# Altium schematic sheet AD_DA.SchDoc
size A4; SheetNumber: 1; SheetTotal: 6
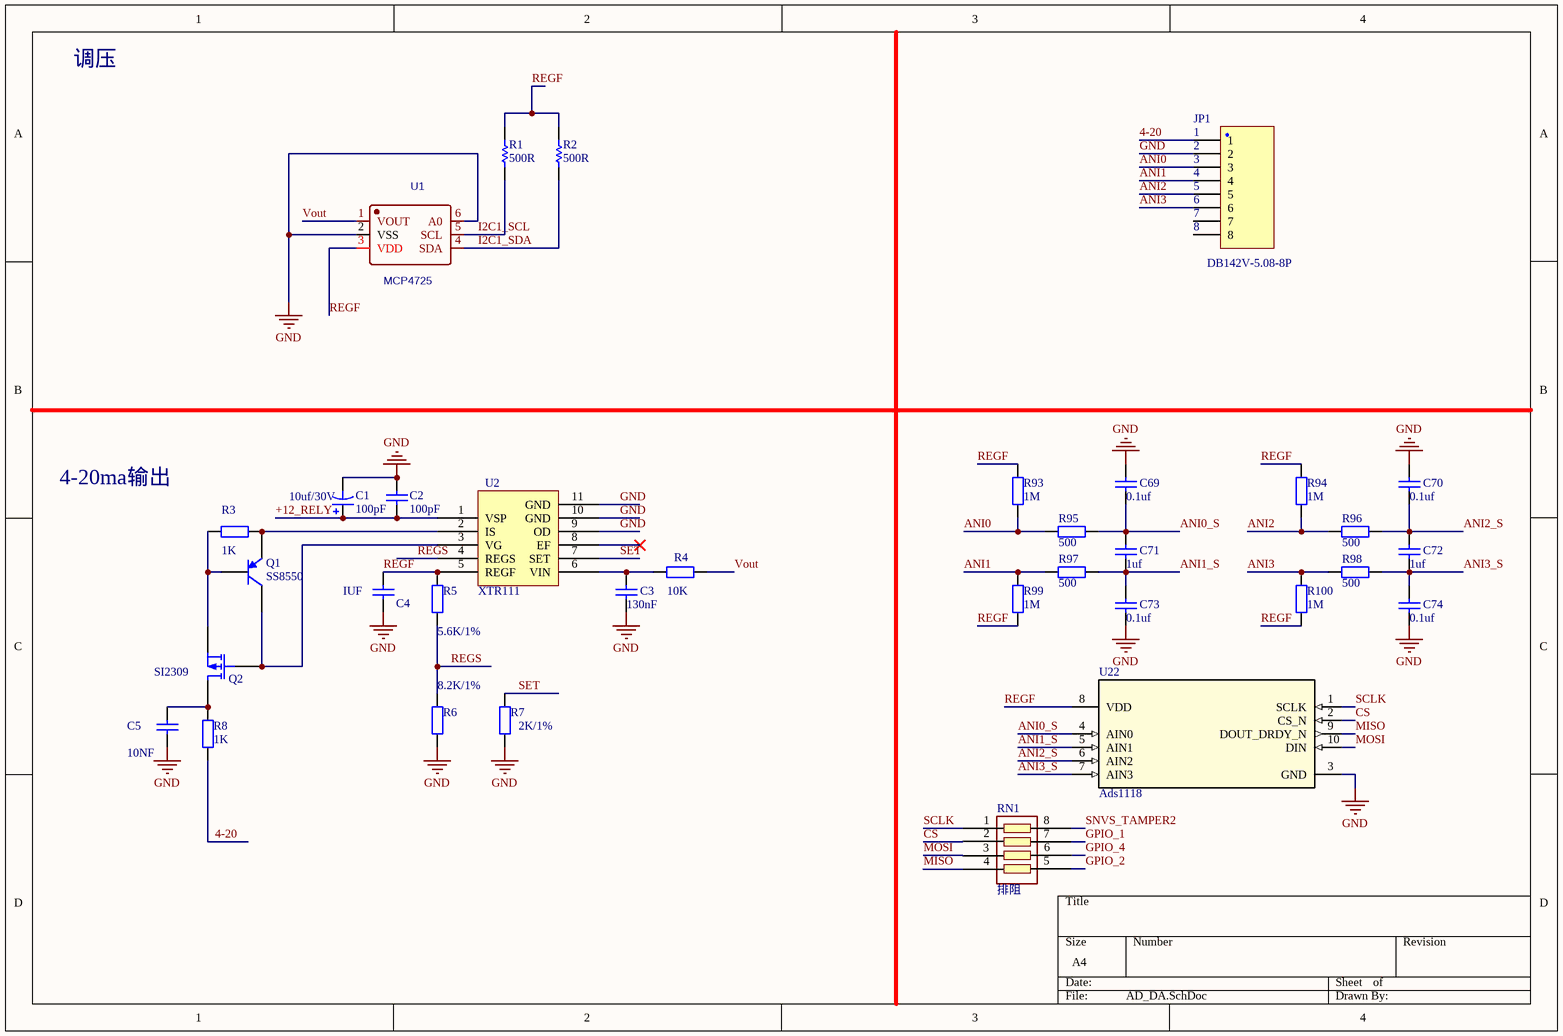
[diagram p0: AD_DA.SchDoc]

## Parts
C1  10uf/30V  value 100pF  [CC5.05.4]
C2  value 100pF  [0603c]  (hidden comment: 104)
C3  130nF  [0603]
C4  IUF  [0603c]
C5  10NF  [0603c]
C69  0.1uf  [0603c]
C70  0.1uf  [0603c]
C71  1uf  [0603c]
C72  1uf  [0603c]
C73  0.1uf  [0603c]
C74  0.1uf  [0603c]
JP1  DB142V-5.08-8P  [DB142V-5.08-8P]
Q1  SS8550  [SOT-23]
Q2  SI2309  [SOT-23]
R1  500R  [0603r]
R2  500R  [0603r]
R3  value 1K  [0603_R]  (hidden comment: 15R)
R4  10K  [0603_R]
R5  5.6K/1%  [0603_R]
R6  8.2K/1%  [0603_R]
R7  2K/1%  [0603_R]
R8  value 1K  [0603_R]  (hidden comment: 15R)
R93  1M  [0603r]
R94  1M  [0603r]
R95  500  [0603r]
R96  500  [0603r]
R97  500  [0603r]
R98  500  [0603r]
R99  1M  [0603r]
R100  1M  [0603r]
RN1  排阻  [RES_Network]
U1  MCP4725  [MCP4725]
U2  XTR111  [XTR111]
U22  Ads1118  [ads1118]

## Nets
GND: C1.2 C2.1 C3.2 C4.1 C5.2 C69.1 C70.1 C73.2 C74.2 JP1.2 R6.2 R7.1 U1.2(VSS) U1.6(A0) U2.9(OD) U2.10(GND) U2.11(GND) U22.3(GND)
4-20: JP1.1 R8.2
+12_RELY: C1.1 C2.2 U2.1(VSP)
ANI0: JP1.3 R93.1 R95.2
ANI0_S: C69.2 C71.1 R95.1 U22.4(AIN0)
ANI1: JP1.4 R97.1 R99.1
ANI1_S: C71.2 C73.1 R97.2 U22.5(AIN1)
ANI2: JP1.5 R94.1 R96.2
ANI2_S: C70.2 C72.1 R96.1 U22.6(AIN2)
ANI3: JP1.6 R98.1 R100.1
ANI3_S: C72.2 C74.1 R98.2 U22.7(AIN3)
CS: RN1.2 U22.2(CS_N)
GPIO_1: RN1.7
GPIO_2: RN1.5
GPIO_4: RN1.6
I2C1_SCL: R1.1 U1.5(SCL)
I2C1_SDA: R2.1 U1.4(SDA)
MISO: RN1.4 U22.9(DOUT_DRDY_N)
MOSI: RN1.3 U22.10(DIN)
REGF: C4.2 R1.2 R2.2 R5.1 R93.2 R94.2 R99.2 R100.2 U1.3(VDD) U2.5(REGF) U22.8(VDD)
REGS: R5.2 R6.1 U2.4(REGS)
SCLK: RN1.1 U22.1(SCLK)
SET: R7.2 U2.7(SET)
SNVS_TAMPER2: RN1.8
Vout: R4.2 U1.1(VOUT)
NetC3_1: C3.1 R4.1 U2.6(VIN)
NetC5_1: C5.1 Q2.1(D) R8.1
NetQ1_1: Q1.1(C) Q2.2(G) U2.3(VG)
NetQ1_2: Q1.2(B) Q2.3(S) R3.2
NetQ1_3: Q1.3(E) R3.1 U2.2(IS)

Not connected (* = marked no-connect by the designer): JP1 7 8; U2 8(EF)*

## Notes on the sheet
- 调压
- 4-20ma输出

## Library data of the parts
C1 = Cap Pol1: Polarized Capacitor (Radial); Published: 8-Jun-2000; LatestRevisionDate: 17-Jul-2002; LatestRevisionNote: Re-released for DXP Platform.; PackageReference: RB7.6-15; Publisher: Altium Limited; PackageDescription: Polarized Capacitor (Radial); 2 Leads
C2 = Cap: Capacitor; Published: 8-Jun-2000; LatestRevisionDate: 17-Jul-2002; LatestRevisionNote: Re-released for DXP Platform.; PackageReference: RAD-0.3; Publisher: Altium Limited; PackageDescription: Radial Cap, Thru-Hole; 2 Leads; 0.3 in Pin Spacing
C3 C69-C74 = Cap Smd: Capacitor
C4 C5 = Cap: Capacitor; Value: 100pF; Published: 8-Jun-2000; LatestRevisionDate: 17-Jul-2002; LatestRevisionNote: Re-released for DXP Platform.; PackageReference: RAD-0.3; Publisher: Altium Limited; PackageDescription: Radial Cap, Thru-Hole; 2 Leads; 0.3 in Pin Spacing
Q1 = PNP: PNP Bipolar Transistor; Published: 8-Jun-2000; LatestRevisionDate: 29-May-2009; LatestRevisionNote: IPC-7351 Footprint Added.; PackageVersion: Aug-1999; PackageReference: SOT-23B; Publisher: Altium Limited; PackageDescription: 3-Pin SOT-23 Package 0.95 mm Pitch, 2.4 mm Lead Span
Q2 = MOSFET-P: P-Channel MOSFET; Published: 8-Jun-2000; LatestRevisionDate: 17-Jul-2002; LatestRevisionNote: Re-released for DXP Platform.; PackageVersion: 1995/1996; PackageReference: E3; Publisher: Altium Limited; PackageDescription: TO, Flat Index; 3 In-Line, Axial Leads; Body Dia. 4.6mm; Lead Dia. 0.5 mm (max)
R1 R2 = RES: Resistor; Value: 1K; Published: 8-Jun-2000; Revision: July-2002: Re-released for DXP Platform.; Publisher: Altium Limited
R3 R8 R93-R100 = Res2: Resistor; Published: 8-Jun-2000; LatestRevisionDate: 17-Jul-2002; LatestRevisionNote: Re-released for DXP Platform.; PackageReference: AXIAL-0.4; Publisher: Altium Limited; PackageDescription: Axial Device, Thru-Hole; 2 Leads; 0.4 in Pin Spacing
  R93 R94 R99 R100: Value: 1M
  R95-R98: Value: 500
R4-R7 = Res2: Resistor; Value: 1K; Published: 8-Jun-2000; LatestRevisionDate: 17-Jul-2002; LatestRevisionNote: Re-released for DXP Platform.; PackageReference: AXIAL-0.4; Publisher: Altium Limited; PackageDescription: Axial Device, Thru-Hole; 2 Leads; 0.4 in Pin Spacing
RN1 = Res_Network
U1 = MCP4725A0T-E/CH: BOM_Manufacturer: MICROCHIP; Contributor: LCSC; BOM_Supplier: LCSC; BOM_Manufacturer Part: MCP4725A0T-E/CH; BOM_Supplier Part: C144198; BOM_JLCPCB Part Class: Extended Part; spicePre: U; spiceSymbolName: MCP4725A0T-E/CH